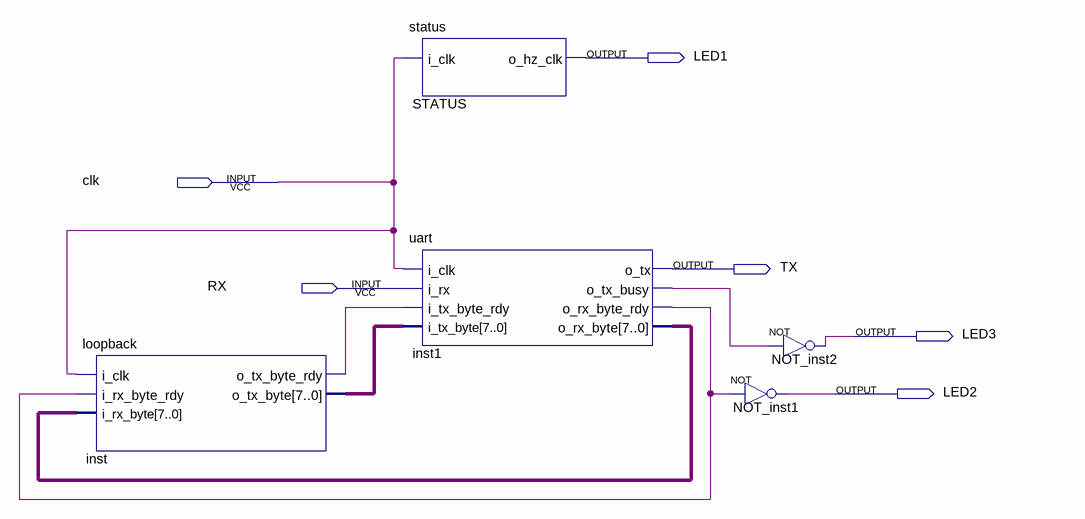
[diagram p0: schematic sheet]
// Quartus schematic vx.bdf as structural Verilog: 5 symbols, 6 pins
module vx (
  input  clk,
  input  RX,
  output LED1,
  output TX,
  output LED3,
  output LED2
);

  wire inst1_o_rx_byte_rdy, inst1_o_tx_busy, inst_o_tx_byte_rdy;
  wire [7:0] inst1_o_rx_byte, inst_o_tx_byte;

  loopback inst (
    .i_clk(clk), .i_rx_byte_rdy(inst1_o_rx_byte_rdy), .i_rx_byte(inst1_o_rx_byte),
    .o_tx_byte_rdy(inst_o_tx_byte_rdy), .o_tx_byte(inst_o_tx_byte));
  status STATUS (.i_clk(clk), .o_hz_clk(LED1));
  uart inst1 (
    .i_clk(clk), .i_rx(RX), .i_tx_byte_rdy(inst_o_tx_byte_rdy), .i_tx_byte(inst_o_tx_byte), .o_tx(TX),
    .o_tx_busy(inst1_o_tx_busy), .o_rx_byte_rdy(inst1_o_rx_byte_rdy), .o_rx_byte(inst1_o_rx_byte));
  not NOT_inst2 (LED3, inst1_o_tx_busy);
  not NOT_inst1 (LED2, inst1_o_rx_byte_rdy);
endmodule
